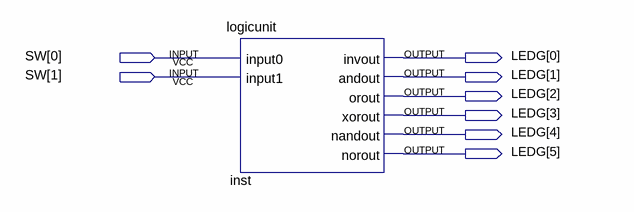
[diagram p0: schematic sheet]
// Quartus schematic LogicTop.bdf as structural Verilog: 1 symbols, 8 pins
module LogicTop (
  input  [1:0] SW,
  output [5:0] LEDG
);

  logicunit inst (
    .input0(SW[0]), .input1(SW[1]), .invout(LEDG[0]), .andout(LEDG[1]), .orout(LEDG[2]), .xorout(LEDG[3]),
    .nandout(LEDG[4]), .norout(LEDG[5]));
endmodule
